# EAGLE design AnalogIn_Teensy_V10 (EAGLE 7.7.0)
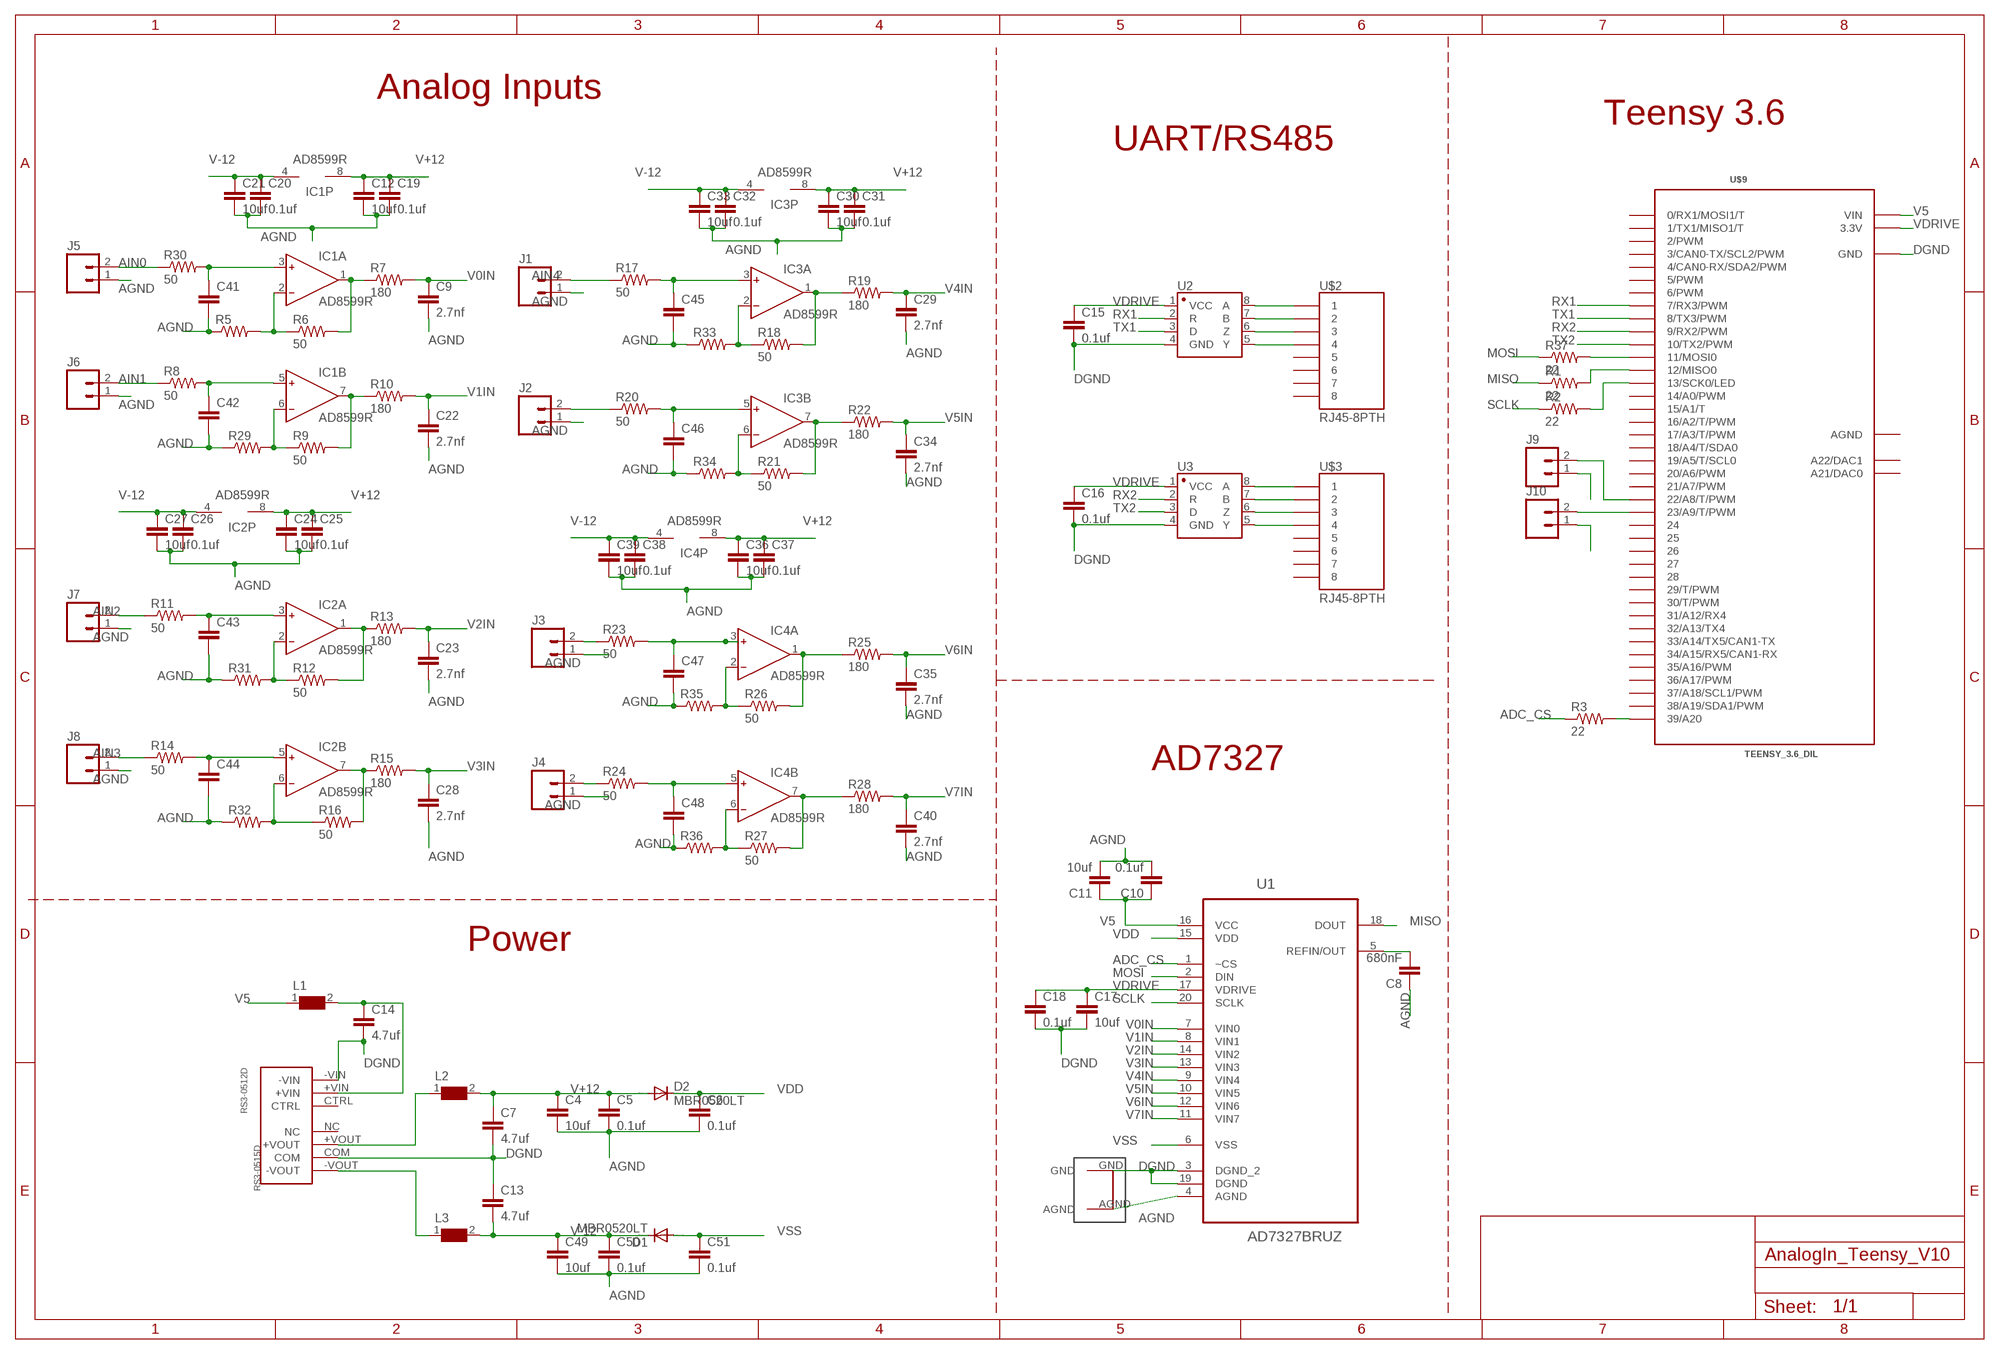
[diagram p0: schematic, sheet 1]

## Parts
C4  10uf  CAP0603-CAP  [0603-CAP]
C5  0.1uf  CAP0603-CAP  [0603-CAP]
C6  0.1uf  CAP0603-CAP  [0603-CAP]
C7  4.7uf  CAP0603-CAP  [0603-CAP]
C8  680nF  CAP0603-CAP  [0603-CAP]
C9  2.7nf  CAP0603-CAP  [0603-CAP]
C10  0.1uf  CAP0603-CAP  [0603-CAP]
C11  10uf  CAP0603-CAP  [0603-CAP]
C12  10uf  CAP0603-CAP  [0603-CAP]
C13  4.7uf  CAP0603-CAP  [0603-CAP]
C14  4.7uf  CAP0603-CAP  [0603-CAP]
C15  0.1uf  CAP0603-CAP  [0603-CAP]
C16  0.1uf  CAP0603-CAP  [0603-CAP]
C17  10uf  CAP0603-CAP  [0603-CAP]
C18  0.1uf  CAP0603-CAP  [0603-CAP]
C19  0.1uf  CAP0603-CAP  [0603-CAP]
C20  0.1uf  CAP0603-CAP  [0603-CAP]
C21  10uf  CAP0603-CAP  [0603-CAP]
C22  2.7nf  CAP0603-CAP  [0603-CAP]
C23  2.7nf  CAP0603-CAP  [0603-CAP]
C24  10uf  CAP0603-CAP  [0603-CAP]
C25  0.1uf  CAP0603-CAP  [0603-CAP]
C26  0.1uf  CAP0603-CAP  [0603-CAP]
C27  10uf  CAP0603-CAP  [0603-CAP]
C28  2.7nf  CAP0603-CAP  [0603-CAP]
C29  2.7nf  CAP0603-CAP  [0603-CAP]
C30  10uf  CAP0603-CAP  [0603-CAP]
C31  0.1uf  CAP0603-CAP  [0603-CAP]
C32  0.1uf  CAP0603-CAP  [0603-CAP]
C33  10uf  CAP0603-CAP  [0603-CAP]
C34  2.7nf  CAP0603-CAP  [0603-CAP]
C35  2.7nf  CAP0603-CAP  [0603-CAP]
C36  10uf  CAP0603-CAP  [0603-CAP]
C37  0.1uf  CAP0603-CAP  [0603-CAP]
C38  0.1uf  CAP0603-CAP  [0603-CAP]
C39  10uf  CAP0603-CAP  [0603-CAP]
C40  2.7nf  CAP0603-CAP  [0603-CAP]
C41  CAP0603-CAP  [0603-CAP]
C42  CAP0603-CAP  [0603-CAP]
C43  CAP0603-CAP  [0603-CAP]
C44  CAP0603-CAP  [0603-CAP]
C45  CAP0603-CAP  [0603-CAP]
C46  CAP0603-CAP  [0603-CAP]
C47  CAP0603-CAP  [0603-CAP]
C48  CAP0603-CAP  [0603-CAP]
C49  10uf  CAP0603-CAP  [0603-CAP]
C50  0.1uf  CAP0603-CAP  [0603-CAP]
C51  0.1uf  CAP0603-CAP  [0603-CAP]
D1  MBR0520LT  [SOD123]
D2  MBR0520LT  [SOD123]
IC1  AD8599R  [SO8]
IC2  AD8599R  [SO8]
IC3  AD8599R  [SO8]
IC4  AD8599R  [SO8]
J1  M023.5MM  [SCREWTERMINAL-3.5MM-2]
J2  M023.5MM  [SCREWTERMINAL-3.5MM-2]
J3  M023.5MM  [SCREWTERMINAL-3.5MM-2]
J4  M023.5MM  [SCREWTERMINAL-3.5MM-2]
J5  M023.5MM  [SCREWTERMINAL-3.5MM-2]
J6  M023.5MM  [SCREWTERMINAL-3.5MM-2]
J7  M023.5MM  [SCREWTERMINAL-3.5MM-2]
J8  M023.5MM  [SCREWTERMINAL-3.5MM-2]
J9  M023.5MM  [SCREWTERMINAL-3.5MM-2]
J10  M023.5MM  [SCREWTERMINAL-3.5MM-2]
L1  WE-CBF-742792118_1206  [1206]
L2  WE-CBF-742792118_1206  [1206]
L3  WE-CBF-742792118_1206  [1206]
R1  22  RESISTOR0603  [0603-RES]
R2  22  RESISTOR0603  [0603-RES]
R3  22  RESISTOR0603  [0603-RES]
R5  RESISTOR0603  [0603-RES]
R6  50  RESISTOR0603  [0603-RES]
R7  180  RESISTOR0603  [0603-RES]
R8  50  RESISTOR0603  [0603-RES]
R9  50  RESISTOR0603  [0603-RES]
R10  180  RESISTOR0603  [0603-RES]
R11  50  RESISTOR0603  [0603-RES]
R12  50  RESISTOR0603  [0603-RES]
R13  180  RESISTOR0603  [0603-RES]
R14  50  RESISTOR0603  [0603-RES]
R15  180  RESISTOR0603  [0603-RES]
R16  50  RESISTOR0603  [0603-RES]
R17  50  RESISTOR0603  [0603-RES]
R18  50  RESISTOR0603  [0603-RES]
R19  180  RESISTOR0603  [0603-RES]
R20  50  RESISTOR0603  [0603-RES]
R21  50  RESISTOR0603  [0603-RES]
R22  180  RESISTOR0603  [0603-RES]
R23  50  RESISTOR0603  [0603-RES]
R24  50  RESISTOR0603  [0603-RES]
R25  180  RESISTOR0603  [0603-RES]
R26  50  RESISTOR0603  [0603-RES]
R27  50  RESISTOR0603  [0603-RES]
R28  180  RESISTOR0603  [0603-RES]
R29  RESISTOR0603  [0603-RES]
R30  50  RESISTOR0603  [0603-RES]
R31  RESISTOR0603  [0603-RES]
R32  RESISTOR0603  [0603-RES]
R33  RESISTOR0603  [0603-RES]
R34  RESISTOR0603  [0603-RES]
R35  RESISTOR0603  [0603-RES]
R36  RESISTOR0603  [0603-RES]
R37  22  RESISTOR0603  [0603-RES]
RS3-0512D  RS3-0515D  [RS3-0515D]
U1  AD7327BRUZ  [SOP65P640X120-20N]
U2  SN65HVD31DR  [SO08]
U3  SN65HVD31DR  [SO08]
U$2  RJ45-8PTH  [RJ45-8]
U$3  RJ45-8PTH  [RJ45-8]
U$4  GNDPLANESHRT  [GNDPLANESHRT]
U$9  TEENSY_3.6_DIL  [TEENSY_3.6_DIL]

## Nets
+VOUT: L2.1 RS3-0512D.+VOUT
-VOUT: L3.1 RS3-0512D.-VOUT
ADC_CS: R3.1 U1.1(~CS)
AGND: C4.2 C5.2 C6.2 C8.1 C9.2 C10.2 C11.2 C12.2 C19.2 C20.2 C21.2 C22.2 C23.2 C24.2 C25.2 C26.2 C27.2 C28.2 C29.2 C30.2 C31.2 C32.2 C33.2 C34.2 C35.2 C36.2 C37.2 C38.2 C39.2 C40.2 C41.2 C42.2 C43.2 C44.2 C45.2 C46.2 C47.2 C48.2 C49.2 C50.2 C51.2 J1.1 J2.1 J3.1 J4.1 J5.1 J6.1 J7.1 J8.1 R5.1 R29.1 R31.1 R32.1 R33.1 R34.1 R35.1 R36.1 U1.4(AGND) U$4.AGND
AIN0: J5.2 R30.1
AIN1: J6.2 R8.1
AIN2: J7.2 R11.1
AIN3: J8.2 R14.1
AIN4: J1.2 R17.1
AIN5: J2.2 R20.1
AIN6: J3.2 R23.1
AIN7: J4.2 R24.1
DGND: C7.2 C13.1 C14.2 C15.2 C16.2 C17.2 C18.2 J9.1 J10.1 RS3-0512D.-VIN RS3-0512D.COM U1.3(DGND_2) U1.19(DGND) U2.4(GND) U3.4(GND) U$4.GND U$9.GND U$9.GND1(GND)
MISO: R1.1 U1.18(DOUT)
MOSI: R37.1 U1.2(DIN)
N$1: U2.6(Z) U$2.3
N$3: U2.8(A) U$2.1
N$4: U2.5(Y) U$2.4
N$5: U2.7(B) U$2.2
N$6: U3.6(Z) U$3.3
N$7: U3.5(Y) U$3.4
N$8: U3.8(A) U$3.1
N$9: U3.7(B) U$3.2
N$10: R37.2 U$9.11(11/MOSI0)
N$11: R1.2 U$9.12(12/MISO0)
N$12: C14.1 L1.2 RS3-0512D.+VIN
N$13: R3.2 U$9.39/A20
N$14: C41.1 IC1.3(A:IN+) R30.2
N$15: R2.2 U$9.13(13/SCK0/LED)
N$16: IC1.2(A:IN-) R5.2 R6.1
N$17: IC1.1(A:OUT) R6.2 R7.1
N$18: J10.2 U$9.23/A9(23/A9/T/PWM)
N$19: J9.2 U$9.22/A8(22/A8/T/PWM)
N$20: C42.1 IC1.5(B:IN+) R8.2
N$21: IC1.6(B:IN-) R9.1 R29.2
N$22: IC1.7(B:OUT) R9.2 R10.1
N$23: C43.1 IC2.3(A:IN+) R11.2
N$24: IC2.2(A:IN-) R12.1 R31.2
N$25: IC2.1(A:OUT) R12.2 R13.1
N$28: C44.1 IC2.5(B:IN+) R14.2
N$29: IC2.6(B:IN-) R16.1 R32.2
N$30: IC2.7(B:OUT) R15.1 R16.2
N$31: C45.1 IC3.3(A:IN+) R17.2
N$32: IC3.2(A:IN-) R18.1 R33.2
N$33: IC3.1(A:OUT) R18.2 R19.1
N$36: C46.1 IC3.5(B:IN+) R20.2
N$37: IC3.6(B:IN-) R21.1 R34.2
N$38: IC3.7(B:OUT) R21.2 R22.1
N$39: C47.1 IC4.3(A:IN+) R23.2
N$40: IC4.2(A:IN-) R26.1 R35.2
N$41: IC4.1(A:OUT) R25.1 R26.2
N$44: C48.1 IC4.5(B:IN+) R24.2
N$45: IC4.6(B:IN-) R27.1 R36.2
N$46: IC4.7(B:OUT) R27.2 R28.1
REF: C8.2 U1.5(REFIN/OUT)
RX1: U2.2(R) U$9.7(7/RX3/PWM)
RX2: U3.2(R) U$9.9(9/RX2/PWM)
SCLK: R2.1 U1.20(SCLK)
TX1: U2.3(D) U$9.8(8/TX3/PWM)
TX2: U3.3(D) U$9.10(10/TX2/PWM)
V0IN: C9.1 R7.2 U1.7(VIN0)
V1IN: C22.1 R10.2 U1.8(VIN1)
V2IN: C23.1 R13.2 U1.14(VIN2)
V3IN: C28.1 R15.2 U1.13(VIN3)
V4IN: C29.1 R19.2 U1.9(VIN4)
V5: C10.1 C11.1 L1.1 U1.16(VCC) U$9.VIN
V5IN: C34.1 R22.2 U1.10(VIN5)
V6IN: C35.1 R25.2 U1.12(VIN6)
V7IN: C40.1 R28.2 U1.11(VIN7)
V+12: C4.1 C5.1 C7.1 C12.1 C19.1 C24.1 C25.1 C30.1 C31.1 C36.1 C37.1 D2.A IC1.8(P:V+) IC2.8(P:V+) IC3.8(P:V+) IC4.8(P:V+) L2.2
V-12: C13.2 C20.1 C21.1 C26.1 C27.1 C32.1 C33.1 C38.1 C39.1 C49.1 C50.1 D1.C IC1.4(P:V-) IC2.4(P:V-) IC3.4(P:V-) IC4.4(P:V-) L3.2
VDD: C6.1 D2.C U1.15(VDD)
VDRIVE: C15.1 C16.1 C17.1 C18.1 U1.17(VDRIVE) U2.1(VCC) U3.1(VCC) U$9.3.3V U$9.3.3V3(3.3V)
VSS: C51.1 D1.A U1.6(VSS)
Unconnected: RS3-0512D.CTRL RS3-0512D.NC U$2.5 U$2.6 U$2.7 U$2.8 U$3.5 U$3.6 U$3.7 U$3.8 U$9.0(0/RX1/MOSI1/T) U$9.1(1/TX1/MISO1/T) U$9.2(2/PWM) U$9.3(3/CAN0-TX/SCL2/PWM) U$9.4(4/CAN0-RX/SDA2/PWM) U$9.5(5/PWM) U$9.6(6/PWM) U$9.14/A0(14/A0/PWM) U$9.15/A1(15/A1/T) U$9.16/A2(16/A2/T/PWM) U$9.17/A3(17/A3/T/PWM) U$9.18/A4(18/A4/T/SDA0) U$9.19/A5(19/A5/T/SCL0) U$9.20/A6(20/A6/PWM) U$9.21/A7(21/A7/PWM) U$9.24 U$9.25 U$9.26 U$9.27 U$9.28 U$9.29(29/T/PWM) U$9.30(30/T/PWM) U$9.31/A12(31/A12/RX4) U$9.32/A13(32/A13/TX4) U$9.33/A14(33/A14/TX5/CAN1-TX) U$9.34/A15(34/A15/RX5/CAN1-RX) U$9.35/A16(35/A16/PWM) U$9.36/A17(36/A17/PWM) U$9.37/A18(37/A18/SCL1/PWM) U$9.38/A19(38/A19/SDA1/PWM) U$9.A21(A21/DAC0) U$9.A22(A22/DAC1)

## Notes on the sheet
- Analog Inputs
- Teensy 3.6
- UART/RS485
- AD7327
- Power

## Power pins joined to a net without a drawn wire
AGND: U$9.AGND

## Library data of the parts
C4-C51 = SparkFun-Capacitors:CAP: Capacitor Standard 0603 ceramic capacitor, and 0.1" leaded capacitor.
D1 D2 = diode:MBR0520LT: SCHOTTKY BARRIER RECTIFIER Source: http://onsemi.com .. MBR0520LT1-D.pdf
IC1-IC4 = analog-devices:AD8599: Single and Dual, Ultralow Distortion, Ultralow Noise Op Amps Source: http://www.analog.com/static/imported-files/data_sheets/AD8597_8599.pdf; MPN: AD8599ARZ; OC_FARNELL: 1438872; OC_NEWARK: 34M5072
J1-J10 = SparkFun-Connectors:M02: Standard 2-pin 0.1" header. Use with - straight break away headers ( PRT-00116) - right angle break away headers (PRT-00553) - swiss pins (PRT-00743) - machine pins (PRT-00117) - female headers (PRT-00115) Molex polarized connector foot print use with: PRT-08233 with associated crimp pins and housings. 2.54_SCREWTERM for use with PRT-10571. 3.5mm Screw Terminal footprints for PRT-08084 5mm Screw Terminal footprints for use with PRT-08432; PROD_ID: CONN-08399
L1-L3 = WE-CBF:WE-CBF: SMD EMI Suppression Ferrite Beads WE-CBF - Excellent anti-EMI properties - Low DC-restistance - Impedances till 3000 ohms - Rated current up to 6 A -- Reliable Ni-Sn electrodes -- Perfect as data lined filter and for uncoupling of distribution voltage; MPN: 742792118; OC_FARNELL: 1800374; OC_NEWARK: 78R5648; PACKAGE: IND-1206; SUPPLIER: Wuerth Elektronik
R1-R3 R5-R37 = SparkFun-Resistors:RESISTOR: Resistor Basic schematic elements and footprints for 0603, 1206, and PTH resistors.
RS3-0512D = JoshParts10:RS3-0515D
U1 = AD7327BRUZ:AD7327BRUZ: 500 kSPS, 8-Channel, Software-Selectable, True Bipolar Input, 12-Bit Plus Sign ADC; MPN: AD7327BRUZ; OC_FARNELL: 1274245; OC_NEWARK: 19M0860; PACKAGE: TSSOP-20; SUPPLIER: Analog devices
U2 U3 = Joshparts4:SN65HVD31DR: A placeholder for generic narrow & wide SOIC8 foorptints - used on the DIP adapter board.
U$2 U$3 = SparkFun:RJ45-8: RJ45 Jack Simple RJ45, 8-pin connection - connector for common Cat5, Cat5e, and Cat6 Ethernet cables. Footprint not yet proven in production. Connector sku is PRT-00643; Breakout PCB sku is BOB-00716.
U$4 = Joshparts2:GNDPLANESHRT
U$9 = Teensy_3_and_LC_Series_Boards_v1.4:TEENSY_3.6_DIL: Teensy 3.6 DIL Package

## Board
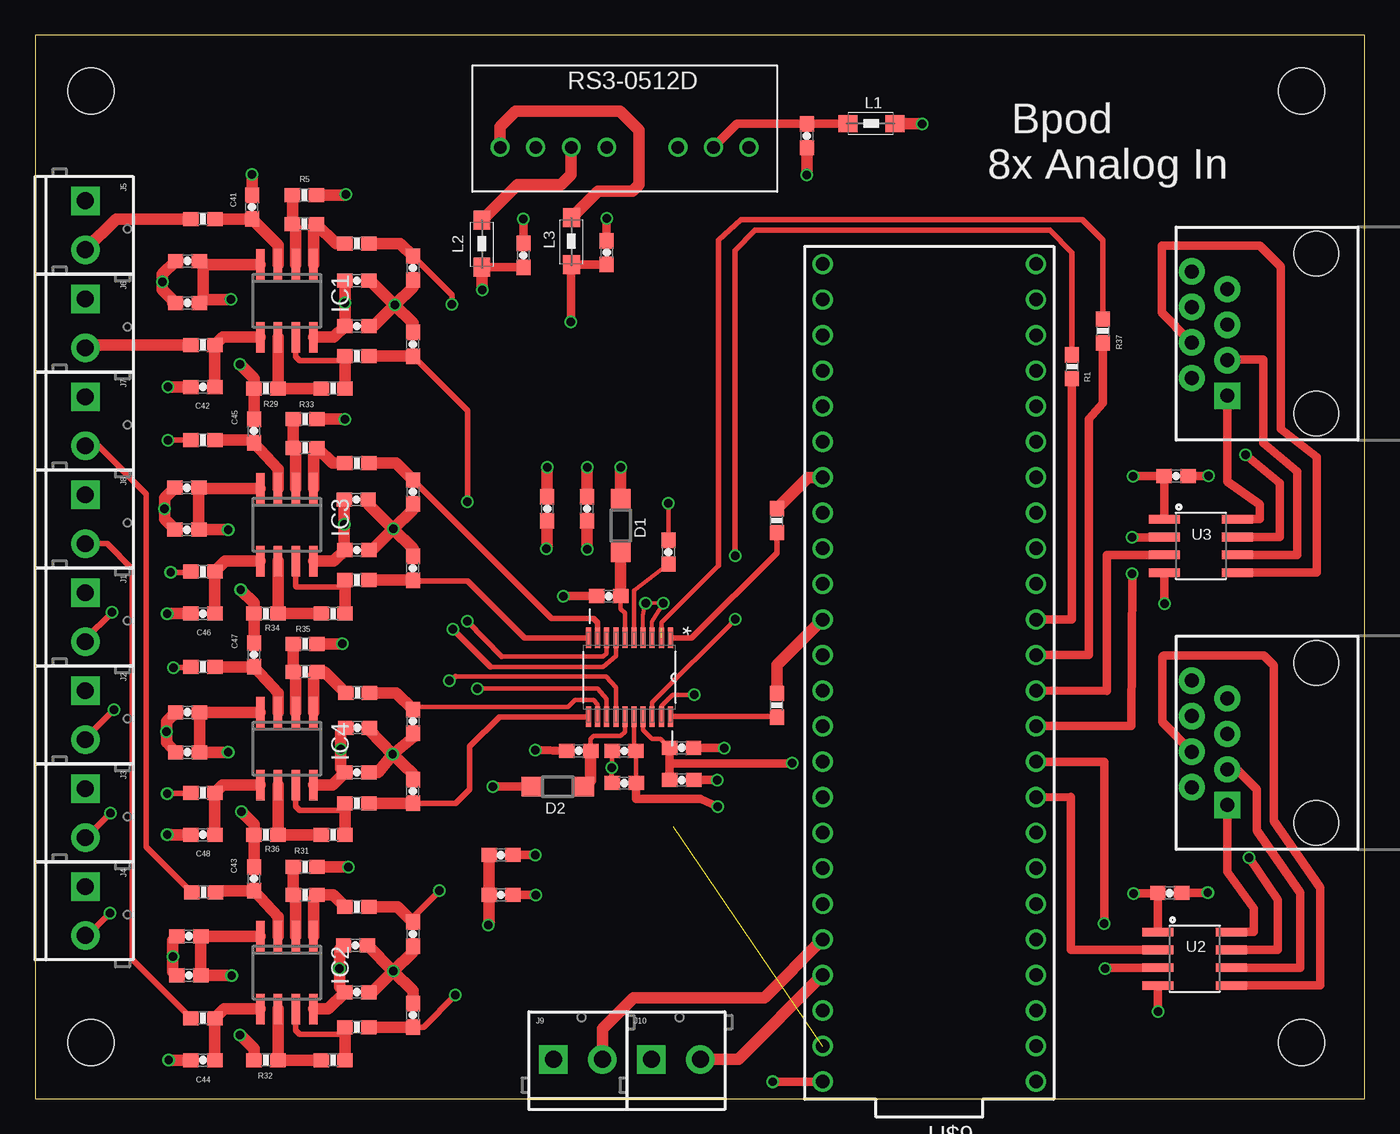
[diagram p1: board, top side]
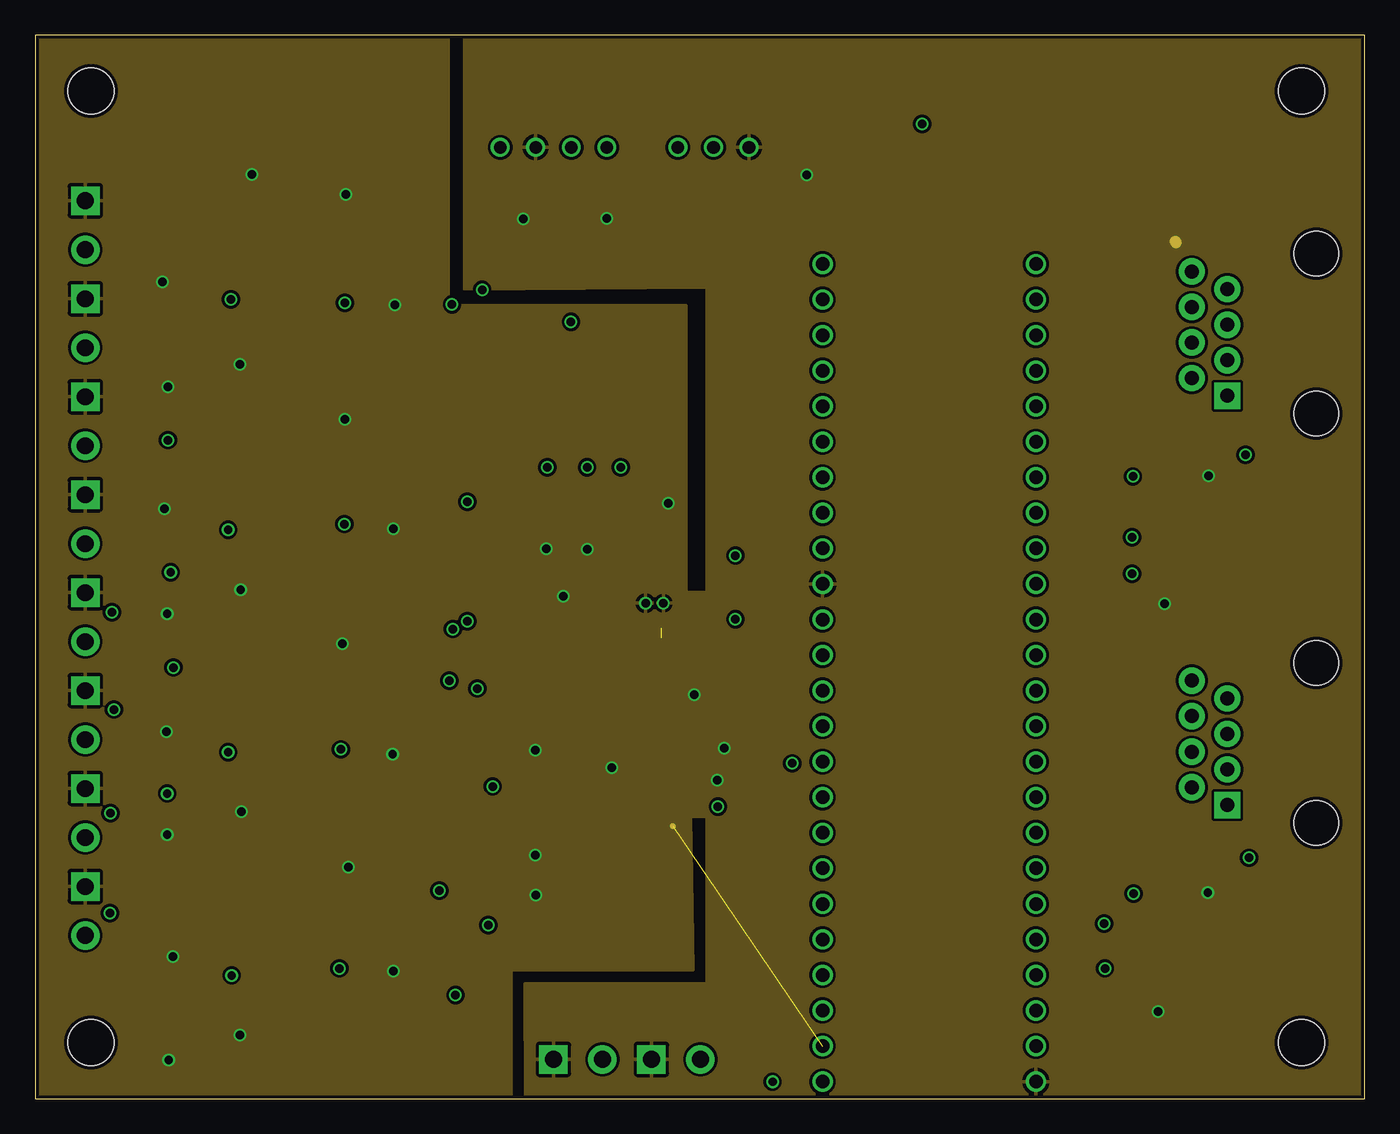
[diagram p2: board, inner layer Route2]
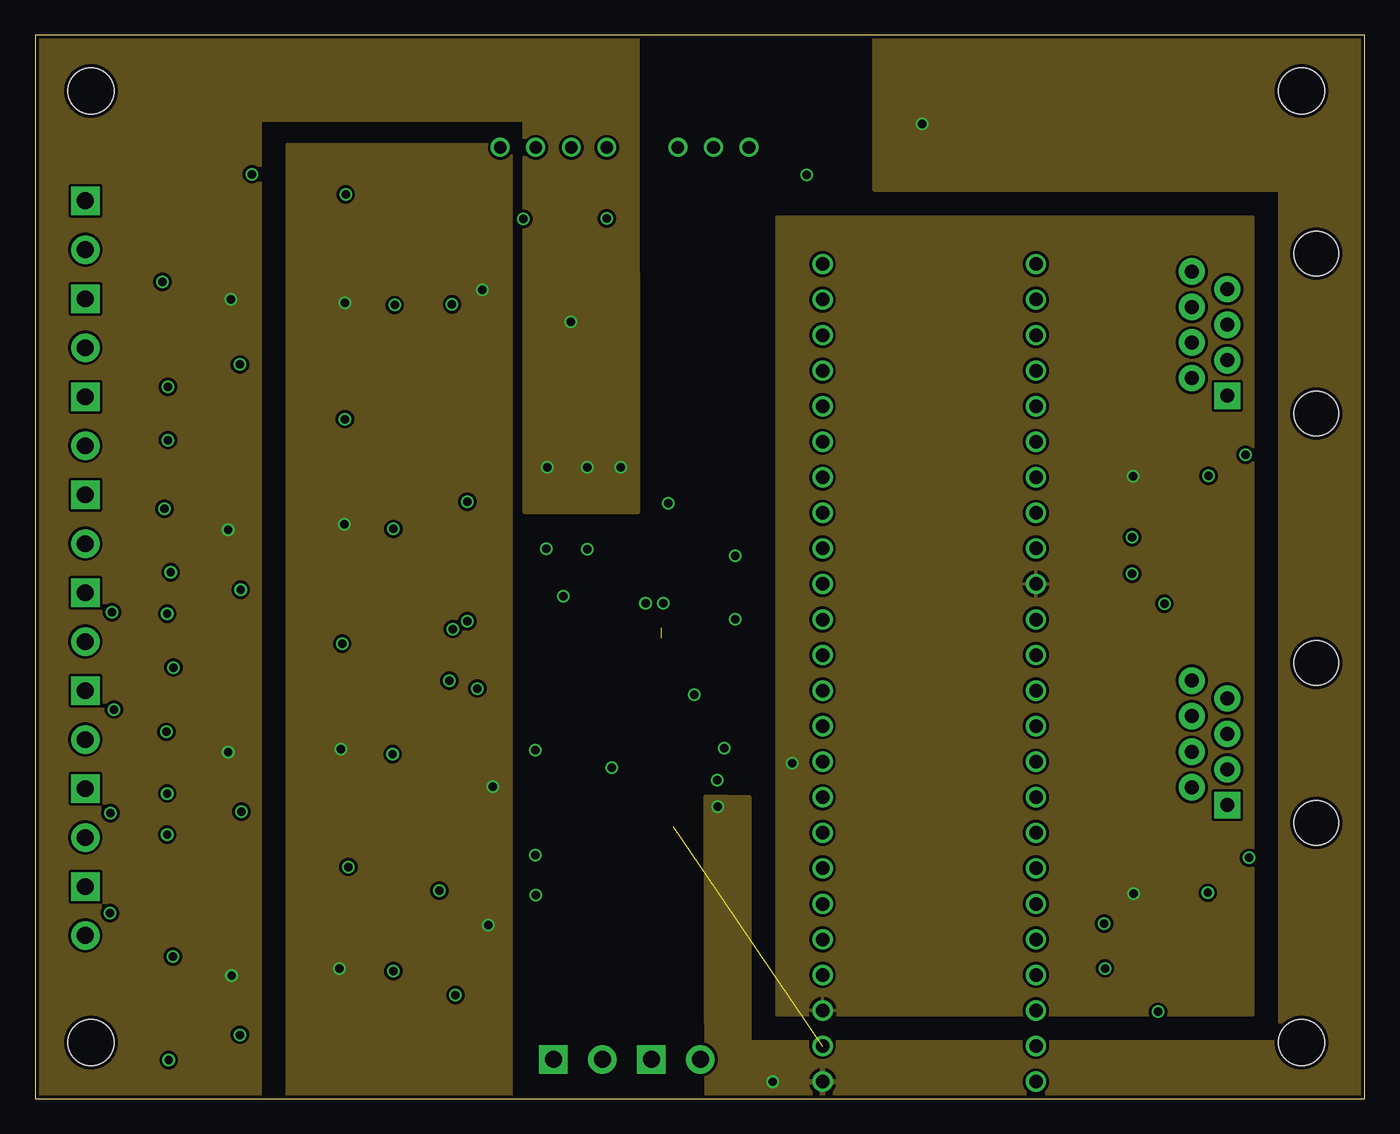
[diagram p3: board, inner layer Route15]
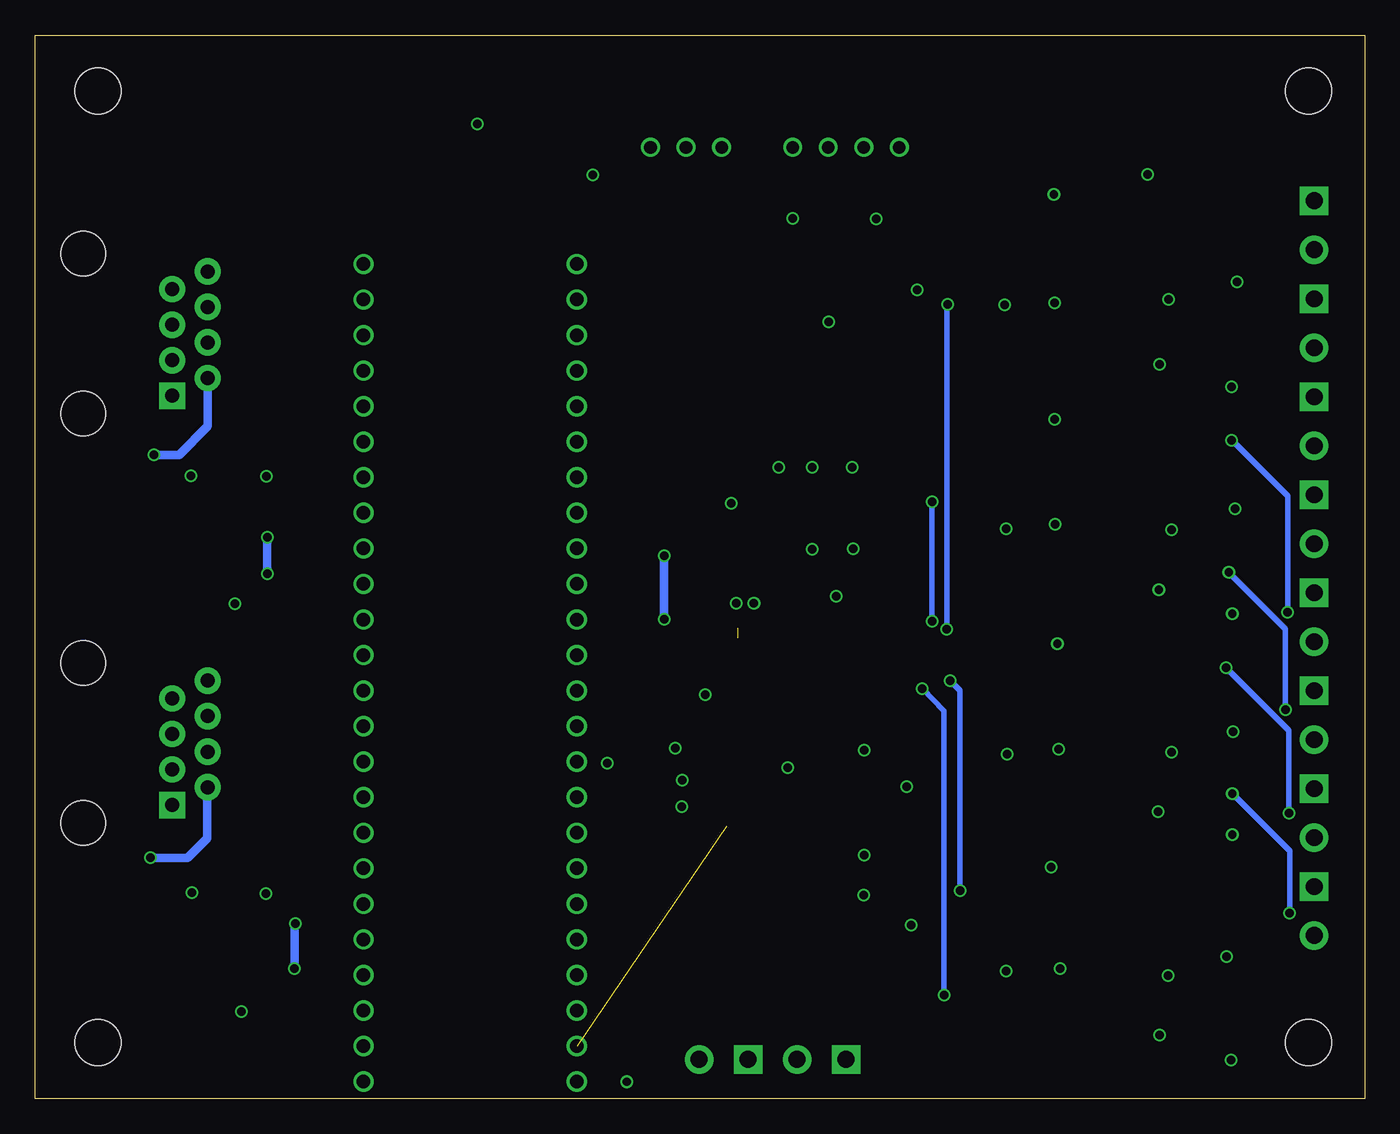
[diagram p4: board, bottom side, seen from below]

Size 95 x 76 mm. Coordinates in mm from the lower left corner, seen from the top.
Outline: 95,0 95,76 0,76 0,0 95,0
Copper layers (1*2*15*16): Top 0.035mm / dielectric 0.2mm / Route2 0.0175mm / dielectric 0.3mm / Route15 0.0175mm / dielectric 0.2mm / Bottom 0.035mm
Design rules "SeeedStudio_4layer_DRU_no_angle_20140221": minimum track width 8mil, minimum drill 12mil, track to track 8mil, track to pad 8mil, pad to pad 8mil, via to via 8mil, smd to smd 0mil, copper to edge 10mil, drill to drill 8mil, minimum pad ring 6mil, minimum via ring 4mil, stop-mask expansion 4mil, vias tented up to drill 25mil, thermal gap 10mil

### Footprints (pad centres in the part's own frame; a part is rotated, then mirrored left to right if it is on the bottom)
0603-CAP = smd 1.1 x 1: 1 -0.85,0; 2 0.85,0
SOD123 = smd 1.4 x 1.4: A 1.9,0; C -1.9,0
SO8 = smd 0.6 x 2.2: 1 -1.905,-2.6; 2 -0.635,-2.6; 3 0.635,-2.6; 4 1.905,-2.6; 5 1.905,2.6; 6 0.635,2.6; 7 -0.635,2.6; 8 -1.905,2.6
SCREWTERMINAL-3.5MM-2 = drill 1.2 pad 2.032 square: 1 0,0 | drill 1.2 pad 2.032: 2 3.5,0
1206 = smd 1.35 x 1.2: 1 -1.675,0; 2 1.675,0
0603-RES = smd 1.1 x 1: 1 -0.85,0; 2 0.85,0
RS3-0515D = drill 0.9: +VIN 7.62,5.08; +VOUT 17.78,5.08; -VIN 5.08,5.08; -VOUT 22.86,5.08; COM 20.32,5.08; CTRL 10.16,5.08; NC 15.24,5.08
SOP65P640X120-20N = smd 1.473 x 0.356: 1 -2.819,2.921; 2 -2.819,2.286; 3 -2.819,1.626; 4 -2.819,0.965; 5 -2.819,0.33; 6 -2.819,-0.33; 7 -2.819,-0.965; 8 -2.819,-1.626; 9 -2.819,-2.286; 10 -2.819,-2.921; 11 2.819,-2.921; 12 2.819,-2.286; 13 2.819,-1.626; 14 2.819,-0.965; 15 2.819,-0.33; 16 2.819,0.33; 17 2.819,0.965; 18 2.819,1.626; 19 2.819,2.286; 20 2.819,2.921
SO08 = smd 0.61 x 2.21: 1 -1.905,-2.616; 2 -0.635,-2.616; 3 0.635,-2.616; 4 1.905,-2.616; 5 1.905,2.616; 6 0.635,2.616; 7 -0.635,2.616; 8 -1.905,2.616
RJ45-8 = drill 1 pad 1.88 square: 1 -4.445,6.35 | drill 1 pad 1.88: 2 -3.175,8.89; 3 -1.905,6.35; 4 -0.635,8.89; 5 0.635,6.35; 6 1.905,8.89; 7 3.175,6.35; 8 4.445,8.89 | hole 3.2: -5.715,0; 5.715,0
GNDPLANESHRT = drill 0.6: AGND -1.27,0; GND 0,0
STAND-OFF = hole 3.302: 0,0
TEENSY_3.6_DIL = drill 0.965: 0 -7.62,25.4; 1 -7.62,22.86; 2 -7.62,20.32; 3 -7.62,17.78; 3.3V 7.62,22.86; 3.3V3 -7.62,-7.62; 4 -7.62,15.24; 5 -7.62,12.7; 6 -7.62,10.16; 7 -7.62,7.62; 8 -7.62,5.08; 9 -7.62,2.54; 10 -7.62,0; 11 -7.62,-2.54; 12 -7.62,-5.08; 13 7.62,-5.08; 14/A0 7.62,-2.54; 15/A1 7.62,0; 16/A2 7.62,2.54; 17/A3 7.62,5.08; 18/A4 7.62,7.62; 19/A5 7.62,10.16; 20/A6 7.62,12.7; 21/A7 7.62,15.24; 22/A8 7.62,17.78; 23/A9 7.62,20.32; 24 -7.62,-10.16; 25 -7.62,-12.7; 26 -7.62,-15.24; 27 -7.62,-17.78; 28 -7.62,-20.32; 29 -7.62,-22.86; 30 -7.62,-25.4; 31/A12 -7.62,-27.94; 32/A13 -7.62,-30.48; 33/A14 7.62,-30.48; 34/A15 7.62,-27.94; 35/A16 7.62,-25.4; 36/A17 7.62,-22.86; 37/A18 7.62,-20.32; 38/A19 7.62,-17.78; 39/A20 7.62,-15.24; A21 7.62,-12.7; A22 7.62,-10.16; AGND 7.62,25.4; GND -7.62,27.94; GND1 7.62,-7.62; VIN 7.62,27.94

### Placement (x,y rotation side)
C4  33.3,17.4 0 top
C5  33.3,14.55 0 top
C6  38.85,24.85 180 top
C7  34.9,60.25 90 top
C8  45.25,39.05 270 top
C9  27,59.35 270 top
C10  42.09,24.84 180 top
C11  42.1,22.54 180 top
C12  23,55.2 0 top
C13  40.85,60.45 270 top
C14  55.15,68.8 270 top
C15  81.54,44.48 0 top
C16  81.08,14.69 0 top
C17  46.21,22.76 0 top
C18  46.2,25.06 0 top
C19  23,58.45 0 top
C20  10.9,59.85 180 top
C21  10.9,56.85 180 top
C22  27,53.9 90 top
C23  27,11.75 270 top
C24  22.9,10.95 0 top
C25  23,7.6 0 top
C26  11,11.6 180 top
C27  11,8.8 180 top
C28  27,5.95 90 top
C29  27,43.35 270 top
C30  23,39.2 0 top
C31  22.95,42.8 0 top
C32  10.85,43.65 180 top
C33  10.85,40.65 180 top
C34  27,37.9 90 top
C35  27,26.95 270 top
C36  23.05,26.5 0 top
C37  23,23.3 0 top
C38  10.9,24.75 180 top
C39  10.9,27.6 180 top
C40  27,21.95 90 top
C41  15.5,63.7 90 top
C42  12,50.85 180 top
C43  15.65,15.7 90 top
C44  12,2.75 180 top
C45  15.65,47.7 90 top
C46  12,34.65 180 top
C47  15.65,31.7 90 top
C48  12,18.85 180 top
C49  39.45,42.15 270 top
C50  36.6,42.15 270 top
C51  41,35.9 180 top
D1  41.85,40.95 270 top
D2  37.35,22.3 180 top
IC1  18,57 180 top
IC2  18,9 180 top
IC3  18,41 180 top
IC4  18,25 180 top
J1  3.6,36.15 270 top
J2  3.6,29.15 270 top
J3  3.6,22.15 270 top
J4  3.6,15.15 270 top
J5  3.6,64.15 270 top
J6  3.6,57.15 270 top
J7  3.6,50.15 270 top
J8  3.6,43.15 270 top
J9  37.05,2.8 0 top
J10  44.05,2.8 0 top
L1  59.76,69.67 180 top
L2  31.93,61.09 270 top
L3  38.33,61.27 270 top
R1  74.1,52.3 270 top
R2  53,28.1 90 top
R3  53,41.3 90 top
R5  19.25,64.55 180 top
R6  19.25,62.5 0 top
R7  23,61.1 0 top
R8  12,53.85 0 top
R9  21.3,50.75 0 top
R10  23,53.05 0 top
R11  12.05,14.75 0 top
R12  19.3,14.55 0 top
R13  23,13.7 0 top
R14  12,5.75 0 top
R15  23,5.1 0 top
R16  21.3,2.75 0 top
R17  12,47.05 0 top
R18  19.3,46.5 0 top
R19  23,45.4 0 top
R20  12,37.65 0 top
R21  21.3,34.65 0 top
R22  23,37.05 0 top
R23  12,30.85 0 top
R24  12,21.85 0 top
R25  23.05,29 0 top
R26  19.3,30.5 0 top
R27  21.3,18.85 0 top
R28  23,21.1 0 top
R29  16.5,50.75 0 top
R30  12,62.85 0 top
R31  19.3,16.55 180 top
R32  16.5,2.75 0 top
R33  19.3,48.55 180 top
R34  16.5,34.65 0 top
R35  19.3,32.5 180 top
R36  16.5,18.85 0 top
R37  76.3,54.85 270 top
RS3-0512D  56.1,73.05 180 top
U1  42.48,30.1 270 top
U2  82.86,9.99 270 top
U3  83.31,39.49 270 top
U$2  91.55,25.42 90 top
U$3  91.55,54.66 90 top
U$4  44.9,35.4 0 top
U$5  [STAND-OFF]  4,4 0 top
U$6  [STAND-OFF]  90.5,4 0 top
U$7  [STAND-OFF]  4,72 0 top
U$8  [STAND-OFF]  90.5,72 0 top
U$9  63.9,29.15 180 top

### Tracks (layer width: path | path; a pad name or v marks a point on that pad's centre or on a via)
+VOUT
  Top 0.61: L2.1 31.97,62.8
  Top 0.813: RS3-0512D.+VOUT 38.32,66.02 37.6,65.3 34.47,65.3 L2.1
-VOUT
  Top 0.813: RS3-0512D.-VOUT 33.24,69.44 34.35,70.55 41.8,70.55 43.15,69.2 43.15,65.3 42.7,64.85 40.23,64.85 L3.1
ADC_CS
  Top 0.305: 45.42,32.9 U1.1
  Top 0.406: 45.42,32.9 46.9,32.9 53,39 R3.1
AGND  (via drill 0.6, 0.6 pad 0.25)  (1 unrouted)
  Top 0.25: U$4.AGND 44.9,35.4
  Top 0.3: U1.4 43.45,34.52 U$4.AGND
  Top 0.305: U1.4 | C8.1 v45.25,42.55 | C10.2 41.24,23.69 v41.2,23.65 41.2,22.59 C11.2
  Top 0.61: C6.2 v35.75,24.9 | C4.2 v35.75,17.4 | C5.2 v35.8,14.55 | C51.2 v37.75,35.9
  Top 0.813: C50.2 36.6,39.35 v36.55,39.3 | C49.2 v39.45,39.25 | R5.1 22.15,64.55 v22.2,64.6 | C12.2 24.2,55.2 v25.7,56.7 | 9.95,59.85 C20.2 9.1,58.9 v9.1,58.35 9.1,57.8 C21.2 9.85,56.85 | C42.2 v9.5,50.85 | v14.65,52.45 15.65,51.45 R29.1 C45.2 | C41.2 v15.5,66.05 | C22.2 27,55.4 v25.7,56.7 | C9.2 27,58 v25.7,56.7 | C29.2 27,42.1 v25.6,40.7 | C34.2 27,39.3 v25.6,40.7 | C30.2 24.1,39.2 v25.6,40.7 | v14.7,36.35 15.65,35.4 R34.1 C47.2 | C46.2 v9.45,34.65 | C33.2 9.25,41.4 v9.25,42.15 9.25,42.9 C32.2 | C19.2 23.95,58.45 v25.7,56.7 | R33.1 v22.15,48.55 | C31.2 23.8,42.5 v25.6,40.7 | C39.2 9.4,26.95 v9.4,26.2 9.4,25.45 C38.2 | C48.2 v9.45,18.85 | R35.1 v21.95,32.5 | C43.2 R36.1 15.65,19.6 v14.75,20.5 | C35.2 27,25.8 v25.55,24.6 | C40.2 27,23.2 v25.55,24.6 | C36.2 23.9,26.3 v25.55,24.6 | C37.2 24.5,23.3 v25.55,24.6 | C26.2 9.85,11.3 v9.85,10.15 9.85,9.05 C27.2 | C44.2 v9.55,2.75 | R32.1 15.65,3.55 v14.65,4.55 | C24.2 v25.6,9.1 | C23.2 27,10.5 v25.6,9.1 | C28.2 27,7.7 v25.6,9.1 | C25.2 24.1,7.6 v25.6,9.1 | R31.1 v22.4,16.55
  Route2 0.406: 45.55,19.5 45.6,19.45
  pour Route2: 0,76 29.5,76 29.5,56.65 46.5,56.65 46.5,26.45 49.4,23.45 49.45,20.1 46.85,20.15 47,9.2 34,9.2 34,0 0,0
AIN0
  Top 0.813: J5.2 5.8,62.85 R30.1
AIN1
  Top 0.813: J6.2 3.8,53.85 R8.1
AIN2
  Top 0.406: R11.1 7.95,18 7.95,43.2 4.5,46.65 J7.2
AIN3
  Top 0.406: R14.1 6.95,9.95 6.95,37.85 5.15,39.65 J8.2
AIN4  (via drill 0.6 pad 0.25)
  Top 0.406: R17.1 v9.5,47.05 | v5.5,34.75 3.6,32.85 J1.2
  Bottom 0.406: v9.5,47.05 5.5,43.05 v5.5,34.75
AIN5  (via drill 0.6 pad 0.25)
  Top 0.406: R20.1 11.1,37.6 v9.7,37.6 | v5.65,27.8 3.6,25.75 J2.2
  Bottom 0.406: v9.7,37.6 5.65,33.55 v5.65,27.8
AIN6  (via drill 0.6 pad 0.25)
  Top 0.406: R23.1 11.1,30.8 v9.9,30.8 | v5.4,20.4 3.65,18.65 J3.2
  Bottom 0.406: v9.9,30.8 5.4,26.3 v5.4,20.4
AIN7  (via drill 0.6 pad 0.25)
  Top 0.406: R24.1 11.1,21.8 v9.45,21.8 | v5.35,13.25 3.75,11.65 J4.2
  Bottom 0.406: v9.45,21.8 5.35,17.7 v5.35,13.25
DGND  (via drill 0.6, 0.6 pad 0.25, 0.6 pad 0.81)
  Top 0.3: U1.3 44.11,34.11 U$4.GND
  Top 0.305: U1.19 44.77,28.07 45.55,28.85 v47.1,28.85
  Top 0.61: U2.4 v80.24,6.2 v80.25,6.2 | C16.2 v83.8,14.7 | C15.2 83.83,44.48 v83.85,44.5 | U3.4 v80.7,35.35 | C13.1 v40.85,62.9 | C7.2 v34.9,62.85 | C18.2 48.96,25.06 v49.25,25.05 | C17.2 48.54,22.76 v48.75,22.75
  Top 0.813: C14.2 v55.15,66
  Route2 0.8: 81.5,61.25 81.55,61.15 81.45,61.25
  pour Route2: 95,76 95,0 35.05,0 35,8.2 48,8.2 48,23 44.5,23 44.5,36.2 48,36.15 48,58 30.7,57.85 30.7,76
MISO  (via drill 0.6)
  Top 0.305: 50,38.85 v50.05,38.8 | U1.18 44.11,28.31 v50.05,34.25
  Top 0.406: R1.1 74.1,60.45 72.5,62.05 51.45,62.05 50,60.6 50,38.85
  Bottom 0.61: v50.05,34.25 v50.05,38.8
MOSI  (1 unrouted)
  Top 0.305: 44.77,33.62 44.77,34.02 48.85,38.1
  Top 0.406: 48.85,38.1 48.85,61.35 50.45,62.8 74.85,62.8 76.3,61.35 R37.1
N$1
  Top 0.61: U2.6 90.4,9.36 90.4,14.7 87.3,19.15 87.3,22.1 85.85,23.55 85.23,23.55 U$2.3
N$3
  Top 0.61: U2.8 87.1,11.89 87.1,13.6 85.2,16.2 U$2.1
N$4
  Top 0.61: U2.5 91.85,8.09 91.85,15.05 88.5,19.85 88.5,30.95 87.8,31.65 80.65,31.65 80.55,31.55 80.55,26.89 U$2.4
N$5  (via drill 0.6)
  Top 0.61: U2.7 88.8,10.62 88.8,14.2 v86.75,17.2
  Bottom 0.61: v86.75,17.2 84.1,17.2 82.7,18.6 82.7,22.2 U$2.2
N$6
  Top 0.61: U3.6 90.2,38.85 90.2,44.8 87.75,46.85 87.75,52.8 85.2,52.8 U$3.3
N$7
  Top 0.61: U3.5 91.6,37.59 91.6,45.85 89,47.85 89,59.45 87.5,60.95 80.5,60.95 80.5,56.15 82.51,54.14 U$3.4
N$8
  Top 0.61: U3.8 87.5,41.4 87.5,42.45 85.2,44.1 U$3.1
N$9  (via drill 0.6)
  Top 0.61: U3.7 88.95,40.12 88.95,44 v86.5,46
  Bottom 0.61: v86.5,46 84.7,46 82.65,48.05 U$3.2
N$10
  Top 0.61: U$9.11 75.3,31.69 75.3,48.55 76.3,49.7 R37.2
N$11
  Top 0.61: U$9.12 74.1,34.23 R1.2
N$12
  Top 0.61: RS3-0512D.+VIN 50.16,69.65 C14.1 55.17,69.67 L1.2
N$13
  Top 0.813: U$9.39/A20 55.24,44.39 R3.2
N$14
  Top 0.813: R30.2 C41.1 17.36,60.98 IC1.3
N$15
  Top 0.813: U$9.13 53,31 R2.2
N$16
  Top 0.813: R5.2 R6.1 18.64,62.22 IC1.2
N$17
  Top 0.813: IC1.1 19.91,62.35 R6.2 21.5,61.1 R7.1
N$18
  Top 0.813: U$9.23/A9 50.25,2.8 J10.2
N$19
  Top 0.813: U$9.22/A8 52.11,7.2 42.75,7.2 40.55,5 J9.2
N$20
  Top 0.813: IC1.5 13.4,54.4 R8.2 C42.1
N$21
  Top 0.813: R9.1 R29.2 17.36,50.77 IC1.6
N$22
  Top 0.406: IC1.7 18.64,53.02 18.9,52.75 21.85,52.75 R10.1
  Top 0.813: R10.1 R9.2
N$23
  Top 0.813: R11.2 13,14.85 C43.1 17.36,12.98 IC2.3
N$24
  Top 0.813: R31.2 R12.1 18.64,14.37 IC2.2
N$25
  Top 0.813: IC2.1 19.91,14.3 R12.2 21.3,14.55 R13.1
N$28
  Top 0.813: IC2.5 13.5,6.4 R14.2 C44.1
N$29
  Top 0.813: R16.1 R32.2 17.36,2.77 IC2.6
N$30
  Top 0.406: IC2.7 18.64,4.87 18.9,4.6 21.65,4.6 R15.1
  Top 0.813: R15.1 R16.2
N$31
  Top 0.813: R17.2 15.3,47.05 C45.1 17.36,44.98 IC3.3
N$32
  Top 0.813: R33.2 R18.1 18.64,46.47 IC3.2
N$33
  Top 0.813: IC3.1 19.91,46.1 R18.2 21.25,45.4 R19.1
N$36
  Top 0.813: IC3.5 13.6,38.4 R20.2 C46.1
N$37
  Top 0.813: R21.1 R34.2 17.36,34.66 IC3.6
N$38
  Top 0.406: IC3.7 18.64,36.62 18.7,36.55 22.15,36.55
  Top 0.813: R22.1 22.15,36.55 R21.2
N$39
  Top 0.813: R23.2 C47.1 17.36,28.98 IC4.3
N$40
  Top 0.813: R35.2 R26.1 18.64,30.32 IC4.2
N$41
  Top 0.813: IC4.1 19.91,30.25 R26.2 20.7,30.5 R25.1
N$44
  Top 0.813: IC4.5 13.4,22.4 R24.2 C48.1
N$45
  Top 0.813: R27.1 R36.2 17.36,18.86 IC4.6
N$46
  Top 0.406: IC4.7 18.64,20.86 18.9,20.6 21.65,20.6 R28.1
  Top 0.813: R28.1 R27.2
REF
  Top 0.305: U1.5 42.81,36.31 C8.2
RX1
  Top 0.61: U$9.7 74,21.55 74,10.62 U2.2
RX2  (via drill 0.6)
  Top 0.61: U$9.9 78.35,26.64 v78.4,37.5 | v78.4,40.1 80.69,40.1 U3.2
  Bottom 0.61: v78.4,37.5 v78.4,40.1
SCLK
  Top 0.305: 45.42,27.3 U1.20
  Top 0.406: 53,27.3 45.42,27.3
  Top 0.813: R2.1 53,27.3
TX1  (via drill 0.6)
  Top 0.61: U$9.8 76.4,24.04 v76.4,12.5 | v76.45,9.3 76.45,9.36 U2.3
  Bottom 0.61: v76.4,12.5 76.45,12.45 v76.45,9.3
TX2
  Top 0.61: U$9.10 76.6,29.13 76.6,38.85 76.69,38.85 U3.3
V0IN  (via drill 0.6 pad 0.25)
  Top 0.305: U1.7 41.52,31.61 40.6,30.85 32.55,30.85
  Top 0.406: 32.55,30.85 v29.85,33.55 | v29.8,56.75 29.8,57.4 C9.1
  Top 0.813: R7.2 26.1,61.1 C9.1
  Bottom 0.406: v29.85,33.55 29.85,56.7 v29.8,56.75
V1IN  (via drill 0.6 pad 0.25)
  Top 0.305: U1.8 40.85,31.8 40.6,31.6 33.35,31.6
  Top 0.406: 33.35,31.6 v30.9,34.1 | v30.9,42.65 30.9,49.15 C22.1
  Top 0.813: R10.2 C22.1
  Bottom 0.406: v30.9,34.1 v30.9,42.65
V2IN  (via drill 0.6 pad 0.25)
  Top 0.305: U1.14 41.52,29.39 40.8,30.15 30.05,30.15
  Top 0.406: 30.05,30.15 v29.6,29.85 | v28.9,14.85 27,12.95 C23.1
  Top 0.813: R13.2 25.9,13.7 C23.1
  Bottom 0.406: v29.6,29.85 28.9,29.15 v28.9,14.85
V3IN  (via drill 0.6 pad 0.25)
  Top 0.305: U1.13 40.85,28.55 40.2,29.3 v31.6,29.3
  Top 0.406: v30.05,7.4 27.75,5.1 C28.1
  Top 0.813: R15.2 C28.1
  Bottom 0.406: v31.6,29.3 30.05,27.7 v30.05,7.4
V4IN
  Top 0.406: U1.9 40.19,34.01 39.9,34.3 36.9,34.3 C29.1
  Top 0.813: R19.2 25.8,45.4 C29.1
V5  (via drill 0.6, 0.6 pad 0.25)
  Top 0.305: U1.16 42.81,24.97 C10.1 C11.1
  Top 0.61: v52.7,1.2 53.93,1.2 U$9.VIN | C11.1 42.95,21.4 47.55,21.4 v48.8,20.85
  Top 0.813: L1.1 v63.4,69.65
  pour Route15: 51,21.5 51,4 89,4 89,65 60,65 60,76 95,76 95,0 48,0 47.95,21.55
V5IN
  Top 0.406: U1.10 34.98,32.92 30.9,37 27.05,37 C34.1
  Top 0.813: R22.2 C34.1
V6IN
  Top 0.305: U1.12 40.19,28.16 39.9,28.5 38.6,28.5 38.1,28 27.2,28 C35.1
  Top 0.813: R25.2 25.8,29 C35.1
V7IN
  Top 0.406: U1.11 33.18,27.28 31.05,25.15 31.05,22.1 30.05,21.1 C40.1
  Top 0.813: R28.2 C40.1
V+12  (via drill 0.6 pad 0.25)
  Top 0.61: L2.2 31.95,59.4 C7.1 | D2.A v32.7,22.3
  Top 0.813: C4.1 C5.1 32.45,12.45 v32.4,12.4 | IC2.8 20.95,6.4 C25.1 21.75,8 v21.75,9.3 21.75,10.65 C24.1 | IC4.8 21.25,22.4 C37.1 21.85,23.6 v21.85,24.95 21.85,26.15 C36.1 | IC3.8 21.35,38.4 C30.1 22.1,39.25 v22.1,41.05 C31.1 | IC1.8 21.35,54.4 C12.1 v22.15,56.85 C19.1 | 31.95,59.4 v31.95,57.8
  pour Route15: 18,68.15 18,0 34,0 34,68.2
V-12  (via drill 0.6 pad 0.25)
  Top 0.61: C13.2 L3.2 38.3,59.56 v38.3,55.5
  Top 0.813: C50.1 v36.6,45.1 | D1.C v41.85,45.1 | C49.1 v39.45,45.1 | IC1.4 12,59.6 | 12,59.6 C20.1 | IC3.4 11.75,43.6 C32.1 C33.1 v13.8,40.65 | IC4.4 C39.1 C38.1 v13.8,24.75 | IC2.4 C26.1 C27.1 v14.05,8.8 | 12,59.6 12,57.1 | 12,57.1 C21.1 | 12,57.1 v14,57.1
  pour Route15: 35,41.95 43.05,41.95 43,76 0,76 0,0 16,0 16,70 35,70
VDD
  Top 0.305: U1.15 42.15,26.2 41.85,25.9 39.9,25.9 39.7,25.7 C6.1
  Top 0.813: D2.C 39.7,22.75 C6.1
VDRIVE  (via drill 0.6)
  Top 0.305: U1.17 43.45,26.36 44.1,25.7 44.71,25.7 C18.1 | C17.1 45.36,23.95
  Top 0.61: U2.1 80.24,14.69 C16.1 80.23,14.65 v78.5,14.65 | v78.45,44.45 78.48,44.48 C15.1 U3.1 | C18.1 C17.1 | 45.36,23.95 53.45,23.95 53.5,23.95 v54.1,23.95
  pour Route15: 87,6 53,6 53,63 87,63
VSS
  Top 0.305: C51.1 41.85,35 42.15,34.7 U1.6
  Top 0.813: C51.1 D1.A

### Text on the board
tNames: Bpod / 8x Analog In